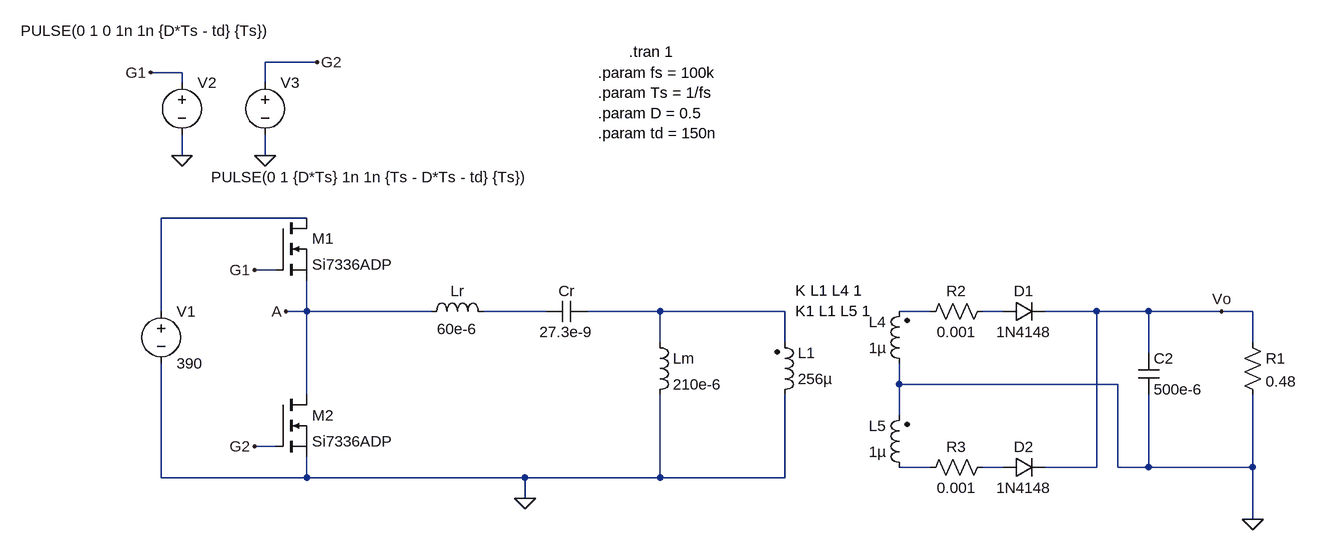
[diagram p0: schematic HB_LLC_TI.asc]
HB_LLC_TI.asc, the LTspice schematic file:
Version 4
SHEET 1 1724 680
WIRE 208 -304 128 -304
WIRE 0 -288 -48 -288
WIRE 0 -272 0 -288
WIRE 128 -272 128 -304
WIRE 0 -160 0 -192
WIRE 128 -160 128 -192
WIRE 192 -64 -32 -64
WIRE 144 16 112 16
WIRE -32 80 -32 -64
WIRE 192 80 192 32
WIRE 192 80 160 80
WIRE 384 80 192 80
WIRE 560 80 464 80
WIRE 736 80 624 80
WIRE 928 80 736 80
WIRE 1152 80 1104 80
WIRE 1264 80 1232 80
WIRE 1408 80 1328 80
WIRE 1488 80 1408 80
WIRE 1600 80 1488 80
WIRE 1648 80 1600 80
WIRE 736 128 736 80
WIRE 928 128 928 80
WIRE 1648 128 1648 80
WIRE 1488 144 1488 80
WIRE 1104 192 1104 160
WIRE 1440 192 1104 192
WIRE 192 208 192 80
WIRE 1104 240 1104 192
WIRE 144 288 112 288
WIRE 1152 320 1104 320
WIRE 1264 320 1232 320
WIRE 1408 320 1408 80
WIRE 1408 320 1328 320
WIRE 1440 320 1440 192
WIRE 1488 320 1488 208
WIRE 1488 320 1440 320
WIRE 1648 320 1648 208
WIRE 1648 320 1488 320
WIRE -32 336 -32 160
WIRE 192 336 192 304
WIRE 192 336 -32 336
WIRE 528 336 192 336
WIRE 736 336 736 208
WIRE 736 336 528 336
WIRE 928 336 928 208
WIRE 928 336 736 336
WIRE 528 368 528 336
WIRE 1648 400 1648 320
FLAG 1648 400 0
FLAG 528 368 0
FLAG 1600 80 Vo
FLAG 112 16 G1
FLAG 112 288 G2
FLAG 160 80 A
FLAG -48 -288 G1
FLAG 128 -160 0
FLAG 208 -304 G2
FLAG 0 -160 0
SYMBOL voltage -32 64 R0
WINDOW 123 0 0 Left 0
WINDOW 39 0 0 Left 0
SYMATTR InstName V1
SYMATTR Value 390
SYMBOL nmos 144 -64 R0
SYMATTR InstName M1
SYMATTR Value Si7336ADP
SYMBOL nmos 144 208 R0
SYMATTR InstName M2
SYMATTR Value Si7336ADP
SYMBOL ind 368 96 R270
WINDOW 0 32 56 VTop 2
WINDOW 3 5 56 VBottom 2
SYMATTR InstName Lr
SYMATTR Value 60e-6
SYMBOL cap 560 96 R270
WINDOW 0 32 32 VTop 2
WINDOW 3 0 32 VBottom 2
SYMATTR InstName Cr
SYMATTR Value 27.3e-9
SYMBOL ind 720 112 R0
SYMATTR InstName Lm
SYMATTR Value 210e-6
SYMBOL ind2 1120 176 R180
WINDOW 0 36 80 Left 2
WINDOW 3 36 40 Left 2
SYMATTR InstName L4
SYMATTR Value 1µ
SYMATTR Type ind
SYMBOL ind2 1120 336 R180
WINDOW 0 36 80 Left 2
WINDOW 3 36 40 Left 2
SYMATTR InstName L5
SYMATTR Value 1µ
SYMATTR Type ind
SYMBOL diode 1264 96 R270
WINDOW 0 32 32 VTop 2
WINDOW 3 0 32 VBottom 2
SYMATTR InstName D1
SYMATTR Value 1N4148
SYMBOL diode 1264 336 R270
WINDOW 0 32 32 VTop 2
WINDOW 3 0 32 VBottom 2
SYMATTR InstName D2
SYMATTR Value 1N4148
SYMBOL cap 1472 144 R0
SYMATTR InstName C2
SYMATTR Value 500e-6
SYMBOL res 1632 112 R0
SYMATTR InstName R1
SYMATTR Value 0.48
SYMATTR SpiceLine tol=1 pwr=250
SYMBOL ind2 912 224 M180
WINDOW 0 36 80 Left 2
WINDOW 3 36 40 Left 2
SYMATTR InstName L1
SYMATTR Value 256µ
SYMATTR Type ind
SYMBOL voltage 0 -288 R0
WINDOW 3 -248 -64 Left 2
WINDOW 123 0 0 Left 0
WINDOW 39 0 0 Left 0
SYMATTR Value PULSE(0 1 0 1n 1n {D*Ts - td} {Ts})
SYMATTR InstName V2
SYMBOL voltage 128 -288 R0
WINDOW 3 -83 161 Left 2
WINDOW 123 0 0 Left 0
WINDOW 39 0 0 Left 0
SYMATTR Value PULSE(0 1 {D*Ts} 1n 1n {Ts - D*Ts - td} {Ts})
SYMATTR InstName V3
SYMBOL res 1248 64 R90
WINDOW 0 0 56 VBottom 2
WINDOW 3 32 56 VTop 2
SYMATTR InstName R2
SYMATTR Value 0.001
SYMBOL res 1248 304 R90
WINDOW 0 0 56 VBottom 2
WINDOW 3 32 56 VTop 2
SYMATTR InstName R3
SYMATTR Value 0.001
TEXT 944 48 Left 2 !K L1 L4 1\nK1 L1 L5 1
TEXT 688 -320 Left 2 !.tran 1
TEXT 640 -288 Left 2 !.param fs = 100k\n.param Ts = 1/fs\n.param D = 0.5\n.param td = 150n

The netlist it stands for:
* HB_LLC_TI.asc
V1 N001 0 390
M1 N001 G1 A A Si7336ADP
M2 A G2 0 0 Si7336ADP
Lr A N002 60e-6
Cr N002 N003 27.3e-9
Lm N003 0 210e-6
L4 0 N004 1µ
L5 N006 0 1µ
D1 N005 Vo 1N4148
D2 N007 Vo 1N4148
C2 Vo 0 500e-6
R1 Vo 0 0.48 tol=1 pwr=250
L1 0 N003 256µ
V2 G1 0 PULSE(0 1 0 1n 1n {D*Ts - td} {Ts})
V3 G2 0 PULSE(0 1 {D*Ts} 1n 1n {Ts - D*Ts - td} {Ts})
R2 N005 N004 0.001
R3 N007 N006 0.001
.model D D
.lib standard.dio
.model NMOS NMOS
.model PMOS PMOS
.lib standard.mos
K L1 L4 1
K1 L1 L5 1
.tran 1
.param fs = 100k
.param Ts = 1/fs
.param D = 0.5
.param td = 150n
.backanno
.end